# EAGLE schematic 29_SmartSensor_HW_PGA ver 0.0.1_PGA460 ver 0.0.6 (EAGLE 9.2.2)
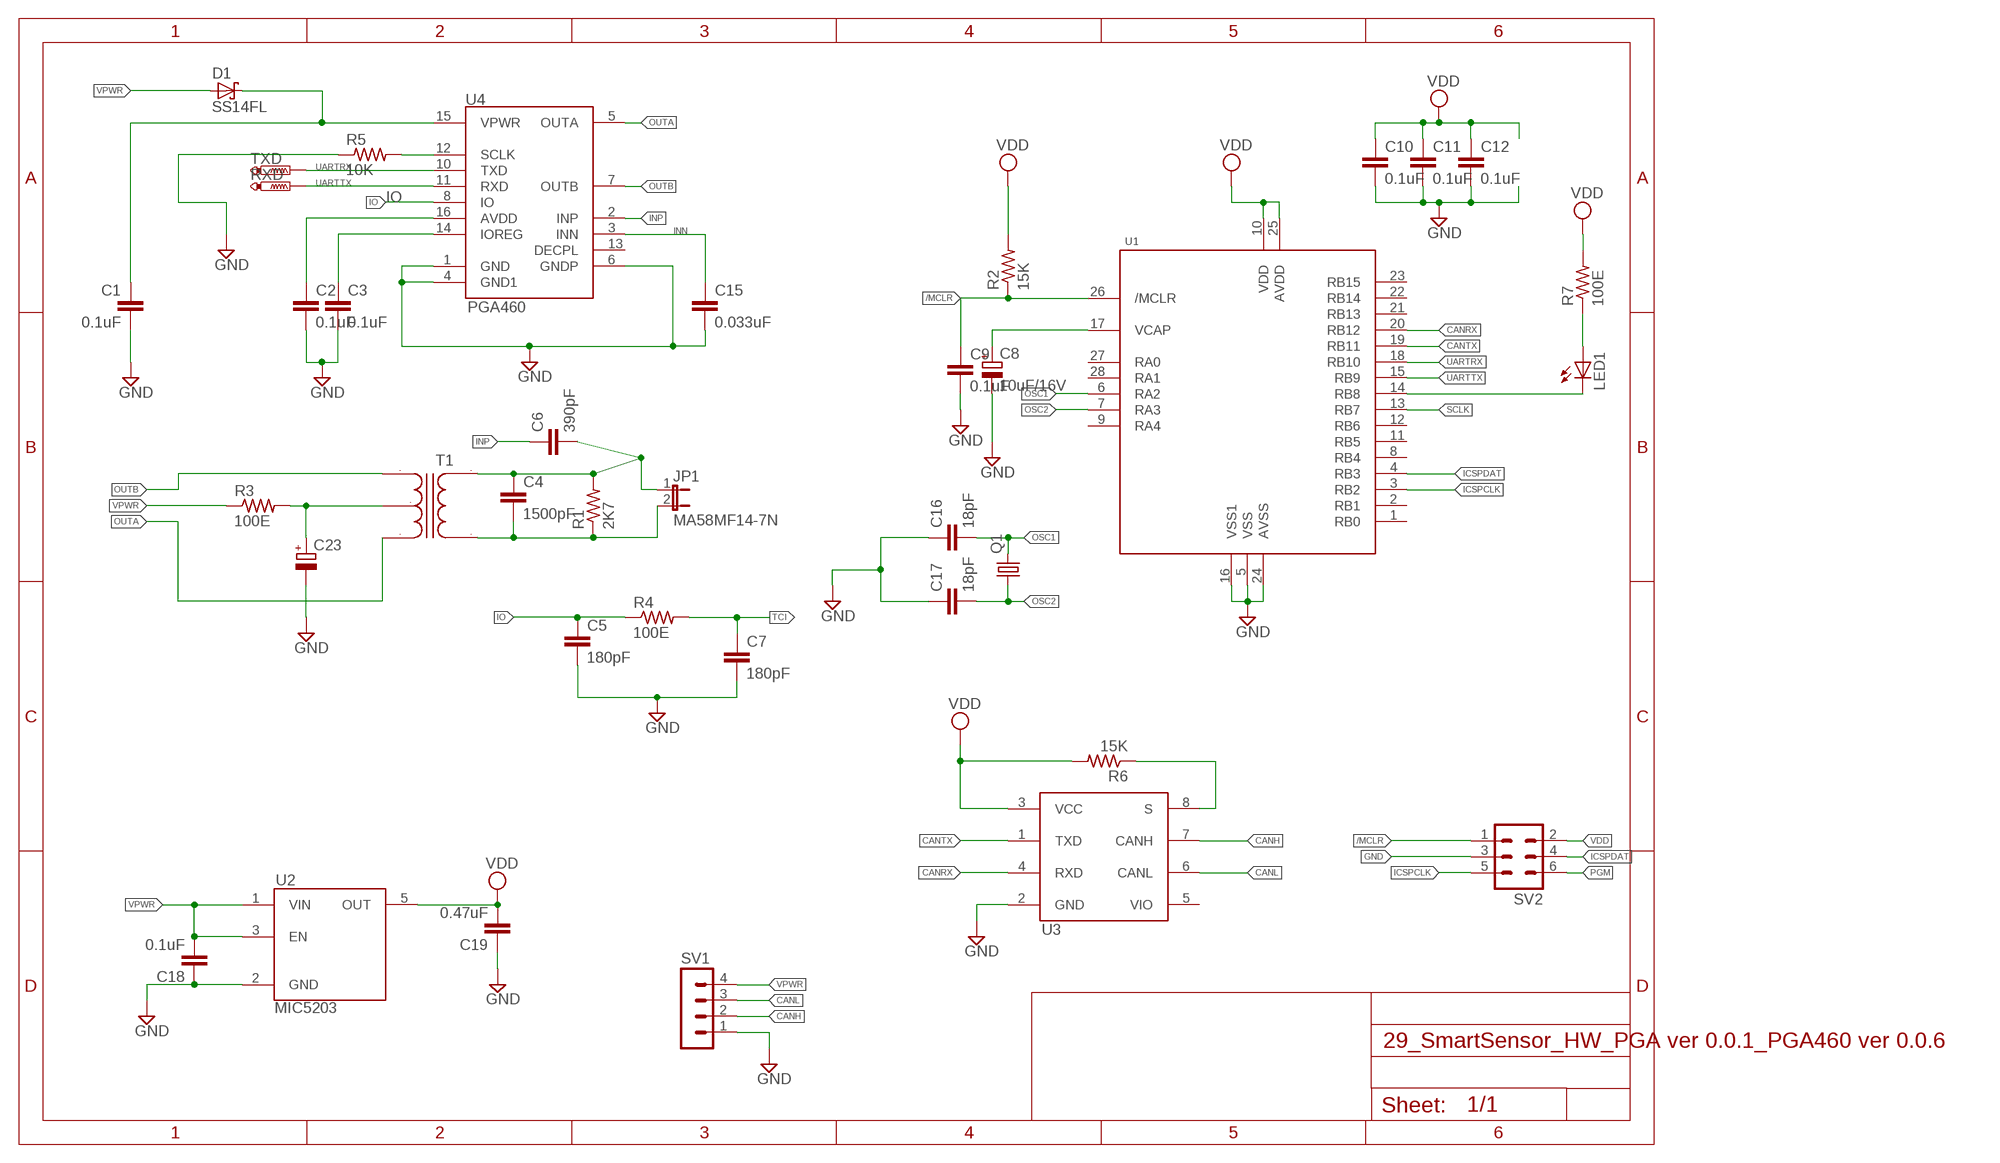
[diagram p0: schematic, sheet 1]

## Parts
C1  0.1uF  C-EUC0603K  [C0603K]
C2  0.1uF  C-EUC0603K  [C0603K]
C3  0.1uF  C-EUC0603K  [C0603K]
C4  1500pF  C-EUC0603K  [C0603K]
C5  180pF  C-EUC0603K  [C0603K]
C6  390pF  C-EUC0603K  [C0603K]
C7  180pF  C-EUC0603K  [C0603K]
C8  10uF/16V  CPOL-EUB/3528-21R  [B/3528-21R]
C9  0.1uF  C-EUC0603K  [C0603K]
C10  0.1uF  C-EUC0603K  [C0603K]
C11  0.1uF  C-EUC0603K  [C0603K]
C12  0.1uF  C-EUC0603K  [C0603K]
C15  0.033uF  C-EUC0603K  [C0603K]
C16  18pF  C-EUC0603K  [C0603K]
C17  18pF  C-EUC0603K  [C0603K]
C18  0.1uF  C-EUC0603K  [C0603K]
C19  0.47uF  C-EUC0603K  [C0603K]
C23  CPOL-EUD  [PANASONIC_D]
D1  SS14FL  SCHOTTKY-DIODESMD  [SMB]
JP1  MA58MF14-7N  JP1E  [JP1]
LED1  LEDCHIPLED_0805  [CHIPLED_0805]
Q1  CRYSTALCTS406  [CTS406]
R1  2K7  R-US_R0603  [R0603]
R2  15K  R-US_R0603  [R0603]
R3  100E  R-US_R0603  [R0603]
R4  100E  R-US_R0603  [R0603]
R5  10K  R-US_R0603  [R0603]
R6  15K  R-US_R0603  [R0603]
R7  100E  R-US_R0603  [R0603]
RXD  TXD  PTR1B1,27  [B1,27]
SV1  MA04-1  [MA04-1]
SV2  MA03-2  [MA03-2]
T1  B78416  [B78416]
TXD  TXD  PTR1B1,27  [B1,27]
U1  DSPIC33EVXXX-28  [QFN65P600X600X100-29T370]
U2  MIC5203  [SOT95P280X110-5]
U3  TCAN1051  [SOIC127P599X265-8]
U4  PGA460  [TSSOP16]

## Nets
/MCLR: C9.1 R2.1 SV2.1 U1.26(/MCLR)
CANH: SV1.2 U3.7(CANH)
CANL: SV1.3 U3.6(CANL)
CANRX: U1.20(RB12) U3.4(RXD)
CANTX: U1.19(RB11) U3.1(TXD)
GND: C1.2 C2.2 C3.2 C5.2 C7.2 C8.- C9.2 C10.2 C11.2 C12.2 C15.2 C16.1 C17.1 C18.1 C19.1 C23.- R5.1 SV1.1 SV2.3 U1.5(VSS) U1.16(VSS1) U1.24(AVSS) U2.2(GND) U3.2(GND) U4.1(GND) U4.4(GND1) U4.6(GNDP)
ICSPCLK: SV2.5 U1.3(RB2)
ICSPDAT: SV2.4 U1.4(RB3)
INN: C15.1 U4.3(INN)
INP: C6.1 U4.2(INP)
IO: C5.1 R4.1 U4.8(IO)
N$1: R5.2 U4.12(SCLK)
N$2: R6.1 U3.8(S)
N$3: LED1.A R7.1
N$4: C23.+ R3.2 T1.2
N$5: C3.1 U4.14(IOREG)
N$6: C2.1 U4.16(AVDD)
N$7: C4.1 C6.2 JP1.1 R1.2 T1.6
N$8: C1.1 D1.C U4.15(VPWR)
N$9: C4.2 JP1.2 R1.1 T1.4
N$10: C8.+ U1.17(VCAP)
N$11: LED1.C U1.14(RB8)
OSC1: C16.2 Q1.3 U1.6(RA2)
OSC2: C17.2 Q1.1 U1.7(RA3)
OUTA: T1.3 U4.5(OUTA)
OUTB: T1.1 U4.7(OUTB)
PGM: SV2.6
SCLK: U1.13(RB7)
TCI: C7.1 R4.2
UARTRX: TXD.TP U1.18(RB10) U4.10(TXD)
UARTTX: RXD.TP U1.15(RB9) U4.11(RXD)
VDD: C10.1 C11.1 C12.1 C19.2 R2.2 R6.2 R7.2 SV2.2 U1.10(VDD) U1.25(AVDD) U2.5(OUT) U3.3(VCC)
VPWR: C18.2 D1.A R3.1 SV1.4 U2.1(VIN) U2.3(EN)
Unconnected: U1.1(RB0) U1.2(RB1) U1.8(RB4) U1.9(RA4) U1.11(RB5) U1.12(RB6) U1.21(RB13) U1.22(RB14) U1.23(RB15) U1.27(RA0) U1.28(RA1) U3.5(VIO) U4.13(DECPL)

## Library data of the parts
C1-C7 C15 = rcl:C-EU: CAPACITOR, European symbol
C8 = rcl:CPOL-EU: POLARIZED CAPACITOR, European symbol; SPICEPREFIX: C
C9-C12 C16-C19 = rcl:C-EU: CAPACITOR, European symbol; SPICEPREFIX: C
C23 = rcl:CPOL-EU: POLARIZED CAPACITOR, European symbol
D1 = diode:SCHOTTKY-DIODE: Schottky Diode
JP1 = jumper:JP1E: JUMPER
LED1 = led:LED: LED OSRAM: - CHIPLED LG R971, LG N971, LY N971, LG Q971, LY Q971, LO R971, LY R971 LH N974, LH R974 LS Q976, LO Q976, LY Q976 LO Q996 - Hyper CHIPLED LW Q18S LB Q993, LB Q99A, LB R99A - SideLED LS A670, LO A670, LY A670, LG A670, LP A670 LB A673, LV A673, LT A673, LW A673 LH A674 LY A675 LS A676, LA A676, LO A676, LY A676, LW A676 LS A679, LY A679, LG A679 - Hyper Micro SIDELED® LS Y876, LA Y876, LO Y876, LY Y876 LT Y87S - SmartLED LW L88C, LW L88S LB L89C, LB L89S, LG L890 LS L89K, LO L89K, LY L89K LS L896, LA L896, LO L896, LY L896 - TOPLED LS T670, LO T670, LY T670, LG T670, LP T670 LSG T670, LSP T670, LSY T670, LOP T670, LYG T670 LG T671, LOG T671, LSG T671 LB T673, LV T673, LT T673, LW T673 LH T674 LS T676, LA T676, LO T676, LY T676, LB T676, LH T676, LSB T676, LW T676 LB T67C, LV T67C, LT T67C, LS T67K, LO T67K, LY T67K, LW E67C LS E67B, LA E67B, LO E67B, LY E67B, LB E67C, LV E67C, LT E67C LW T67C LS T679, LY T679, LG T679 LS T770, LO T770, LY T770, LG T770, LP T770 LB T773, LV T773, LT T773, LW T773 LH T774 LS E675, LA E675, LY E675, LS T675 LS T776, LA T776, LO T776, LY T776, LB T776 LHGB T686 LT T68C, LB T68C - Hyper Mini TOPLED® LB M676 - Mini TOPLED Santana® LG M470 LS M47K, LO M47K, LY M47K Source: http://www.osram.convergy.de LUXEON: - LUMILED® LXK2-PW12-R00, LXK2-PW12-S00, LXK2-PW14-U00, LXK2-PW14-V00 LXK2-PM12-R00, LXK2-PM12-S00, LXK2-PM14-U00 LXK2-PE12-Q00, LXK2-PE12-R00, LXK2-PE12-S00, LXK2-PE14-T00, LXK2-PE14-U00 LXK2-PB12-K00, LXK2-PB12-L00, LXK2-PB12-M00, LXK2-PB14-N00, LXK2-PB14-P00, LXK2-PB14-Q00 LXK2-PR12-L00, LXK2-PR12-M00, LXK2-PR14-Q00, LXK2-PR14-R00 LXK2-PD12-Q00, LXK2-PD12-R00, LXK2-PD12-S00 LXK2-PH12-R00, LXK2-PH12-S00 LXK2-PL12-P00, LXK2-PL12-Q00, LXK2-PL12-R00 Source: www.luxeon.com KINGBRIGHT: KA-3528ASYC Source: www.kingbright.com
Q1 = crystal:CRYSTAL: CRYSTAL; OC_FARNELL: unknown; OC_NEWARK: unknown
R1 R3-R5 R7 = rcl:R-US_: RESISTOR, American symbol
R2 R6 = rcl:R-US_: RESISTOR, American symbol; SPICEPREFIX: R
RXD TXD = testpad:PTR1: TEST PIN
SV1 = con-lstb:MA04-1: PIN HEADER; OC_FARNELL: unknown; OC_NEWARK: unknown
SV2 = con-lstb:MA03-2: PIN HEADER; OC_FARNELL: unknown; OC_NEWARK: unknown
T1 = CustomMy:B78416: SMT transformer for ultrasonic sensors B78416A2232A003
U1 = CustomMy:DSPIC33EVXXX-28
U2 = CustomMy:MIC5203: MIC5203 uCap 80mA Low-Dropout Regulator
U3 = CustomMy:TCAN1051: TCAN1051-Q1 Automotive Fault Protected CAN Transceiver with CAN FD
U4 = texas:PGA460: PGA460 Ultrasonic Signal Processor and Transducer Driver